# Altium schematic sheet Line 5V.SchDoc
size A4; SheetNumber: 13; SheetTotal: 13
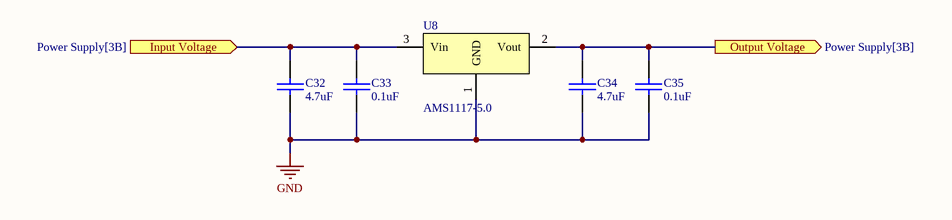
[diagram p0: Line 5V.SchDoc]

## Parts
C32  4.7uF  [0805 Capicator]
C33  0.1uF  [0805 Capicator]
C34  4.7uF  [0805 Capicator]
C35  0.1uF  [0805 Capicator]
U8  AMS1117-5.0  [SOT-223]

## Ports
Input Voltage (in, see Power Supply[3B]), Output Voltage (out, see Power Supply[3B])

## Nets
GND: C32.1 C33.1 C34.1 C35.1 U8.1(GND)
Input Voltage: C32.2 C33.2 U8.3(Vin) ; port Input Voltage
Output Voltage: C34.2 C35.2 U8.2(Vout) ; port Output Voltage

## Library data of the parts
C32 C34 = Cap 4.7uF (0805): 4.7uF X5R 10% 25V 0805; Manufacturer: Murata Manufacturing; Part Number: GRM21BR61E475KA12L; Type: Capacitor; ComponentLink1Description: Chip&Dip; ComponentLink1URL: https://www.chipdip.ru/product/grm21br61e475ka12l
C33 C35 = Cap 0.1uF (0805): 0.1uF X7R 25V 10% 0805; Manufacturer: Murata Manufacturing; Part Number: GRM21BR71E104KA01L; Type: Capacitor; ComponentLink1Description: Chip&Dip; ComponentLink1URL: https://www.chipdip.ru/product/grm21br71e104ka01l
U8 = LDO AMS1117-5.0: 1A 5V LOW DROPOUT VOLTAGE REGULATOR; Type: IC; ComponentLink1Description: Buy; ComponentLink1URL: https://radioremont.com/product/mikroskhema-ams1117-5-0v-sot-223-k35-25/; ComponentLink2Description: Datasheet; ComponentLink2URL: https://radioremont.com/wa-data/public/shop/products/90/27/2790/attachments/AMS1117.pdf